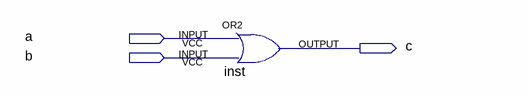
[diagram p0: schematic sheet]
// Quartus schematic or2_cstm.bdf as structural Verilog: 1 symbols, 3 pins
module or2_cstm (
  input  a,
  input  b,
  output c
);

  or inst (c, a, b);
endmodule
